# EAGLE design esp32_master_board (EAGLE 9.6.2)
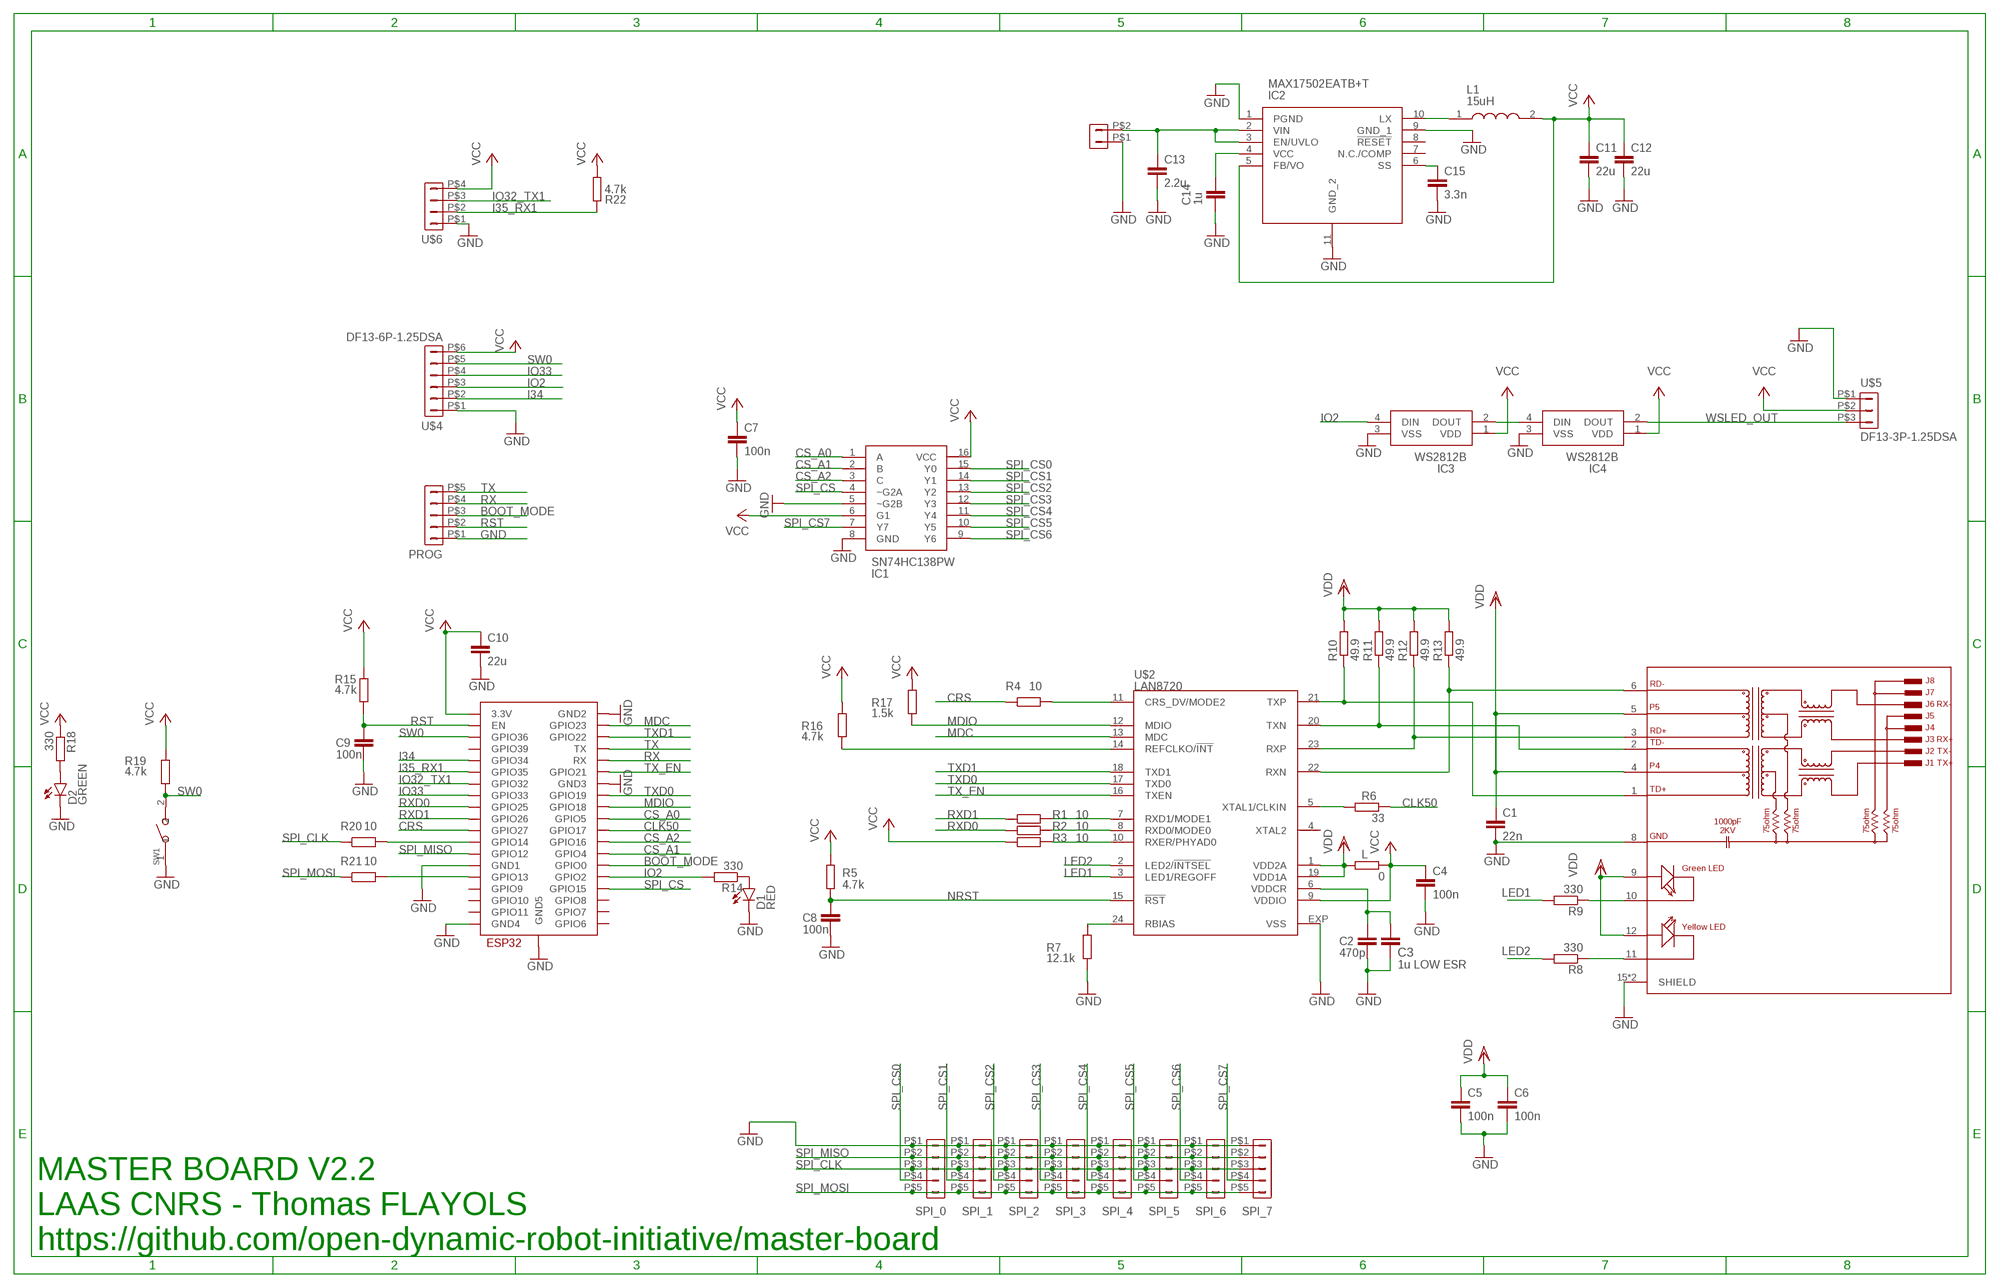
[diagram p0: schematic, sheet 1]

## Parts
C1  22n  C-EUC0402  [0402]
C2  470p  C-EUC0402  [0402]
C3  1u LOW ESR  C-EUC0402  [0402]
C4  100n  C-EUC0402  [0402]
C5  100n  C-EUC0402  [0402]
C6  100n  C-EUC0402  [0402]
C7  100n  C-EUC0402  [0402]
C8  100n  C-EUC0402  [0402]
C9  100n  C-EUC0402  [0402]
C10  22u  C-EUC0805  [C0805]
C11  22u  C-EUC0805  [C0805]
C12  22u  C-EUC0805  [C0805]
C13  2.2u  C-EUC1210  [C1210]
C14  1u  C-EUC0402  [0402]
C15  3.3n  C-EUC0402  [0402]
D1  RED  LEDCHIPLED_0603  [CHIPLED_0603]
D2  GREEN  LEDCHIPLED_0603  [CHIPLED_0603]
IC1  SN74HC138PW  [SOP65P640X120-16N]
IC2  MAX17502EATB+T  [SON50P200X300X80-11N]
IC3  WS2812B  [WS2812B]
IC4  WS2812B  [WS2812B]
L  0  R-EU_R0402  [0402]
L1  15uH  LPS6235-153MRB  [LPS6235]
POWER  DF13-2P-1.25DSA  [DF13-2P-1.25DSA]
PROG  DF13-5P-1.25DSA  [DF13-5P-1.25DSA]
R1  10  R-EU_R0402  [0402]
R2  10  R-EU_R0402  [0402]
R3  10  R-EU_R0402  [0402]
R4  10  R-EU_R0402  [0402]
R5  4.7k  R-EU_R0402  [0402]
R6  33  R-EU_R0402  [0402]
R7  12.1k  R-EU_R0402  [0402]
R8  330  R-EU_R0402  [0402]
R9  330  R-EU_R0402  [0402]
R10  49.9  R-EU_R0402  [0402]
R11  49.9  R-EU_R0402  [0402]
R12  49.9  R-EU_R0402  [0402]
R13  49.9  R-EU_R0402  [0402]
R14  330  R-EU_R0402  [0402]
R15  4.7k  R-EU_R0402  [0402]
R16  4.7k  R-EU_R0402  [0402]
R17  1.5k  R-EU_R0402  [0402]
R18  330  R-EU_R0402  [0402]
R19  4.7k  R-EU_R0402  [0402]
R20  10  R-EU_R0402  [0402]
R21  10  R-EU_R0402  [0402]
R22  4.7k  R-EU_R0402  [0402]
SPI_0  DF13-5P-1.25DSA  [DF13-5P-1.25DSA]
SPI_1  DF13-5P-1.25DSA  [DF13-5P-1.25DSA]
SPI_2  DF13-5P-1.25DSA  [DF13-5P-1.25DSA]
SPI_3  DF13-5P-1.25DSA  [DF13-5P-1.25DSA]
SPI_4  DF13-5P-1.25DSA  [DF13-5P-1.25DSA]
SPI_5  DF13-5P-1.25DSA  [DF13-5P-1.25DSA]
SPI_6  DF13-5P-1.25DSA  [DF13-5P-1.25DSA]
SPI_7  DF13-5P-1.25DSA  [DF13-5P-1.25DSA]
SW1  B3U-1000P-2P-SMD  SMD-BUTTON(2P-3.0X2.5X1.2+0.4MM)-B3U-1000P-2P-SMD  [SW2-2.6-3.0X2.5X1.2+0.4MM]
U$1  ESP32-WROOM  [ESP32-WROOM]
U$2  LAN8720  [QFN24]
U$3  HR911105A  [HANRUN_HR911105A]
U$4  DF13-6P-1.25DSA  [DF13-6P-1.25DSA]
U$5  DF13-3P-1.25DSA  [DF13-3P-1.25DSA]
U$6  DF13-4P-1.25DSA  [DF13-4P-1.25DSA]

## Nets
BOOT_MODE: PROG.P$3 U$1.IO0(GPIO0)
CLK50: R6.1 U$1.IO17(GPIO17)
CRS: R4.1 U$1.IO27(GPIO27)
CS_A0: IC1.1(A) U$1.IO5(GPIO5)
CS_A1: IC1.2(B) U$1.IO4(GPIO4)
CS_A2: IC1.3(C) U$1.IO16(GPIO16)
GND: C1.2 C2.2 C3.2 C4.2 C5.2 C6.2 C7.2 C8.2 C9.2 C10.2 C11.2 C12.2 C13.2 C14.1 C15.2 D1.C D2.C IC1.5(~G2B) IC1.8(GND) IC2.1(PGND) IC2.9(GND_1) IC2.11(GND_2) IC3.3(VSS) IC4.3(VSS) POWER.P$1 PROG.P$1 R7.1 SPI_0.P$1 SPI_1.P$1 SPI_2.P$1 SPI_3.P$1 SPI_4.P$1 SPI_5.P$1 SPI_6.P$1 SPI_7.P$1 SW1.1 U$1.GND1 U$1.GND2 U$1.GND3 U$1.GND4 U$1.GND5 U$2.EXP(VSS) U$3.8(GND) U$3.15(SHIELD) U$3.16(SHIELD) U$4.P$1 U$5.P$1 U$6.P$1
I34: U$1.IO34(GPIO34) U$4.P$2
I35_RX1: R22.2 U$1.IO35(GPIO35) U$6.P$2
IO2: IC3.4(DIN) R14.2 U$1.IO2(GPIO2) U$4.P$3
IO32_TX1: U$1.IO32(GPIO32) U$6.P$3
IO33: U$1.IO33(GPIO33) U$4.P$4
LED1: R9.2 U$2.3(LED1/REGOFF)
LED2: R8.2 U$2.2(LED2/!INTSEL)
MDC: U$1.IO23(GPIO23) U$2.13(MDC)
MDIO: R17.1 U$1.IO18(GPIO18) U$2.12(MDIO)
N$1: R1.2 U$2.7(RXD1/MODE1)
N$2: R2.2 U$2.8(RXD0/MODE0)
N$3: R3.2 U$2.10(RXER/PHYAD0)
N$4: R4.2 U$2.11(CRS_DV/MODE2)
N$5: R6.2 U$2.5(XTAL1/CLKIN)
N$6: R7.2 U$2.24(RBIAS)
N$7: R10.1 U$2.21(TXP) U$3.1(TD+)
N$8: R11.1 U$2.20(TXN) U$3.2(TD-)
N$9: R12.1 U$2.23(RXP) U$3.3(RD+)
N$10: R13.1 U$2.22(RXN) U$3.6(RD-)
N$11: R8.1 U$3.11(YC)
N$12: R9.1 U$3.10(GC)
N$13: R16.1 U$2.14(REFCLKO/!INT)
N$14: C2.1 C3.1 U$2.6(VDDCR)
N$15: C14.2 IC2.4(VCC)
N$16: D1.A R14.1
N$17: R21.2 U$1.IO13(GPIO13)
N$18: IC2.10(LX) L1.1
N$19: IC3.2(DOUT) IC4.4(DIN)
N$20: D2.A R18.2
N$21: R20.2 U$1.IO14(GPIO14)
N$23: C15.1 IC2.6(SS)
N$25: C13.1 IC2.2(VIN) IC2.3(EN/UVLO) POWER.P$2
NRST: C8.1 R5.1 U$2.15(!RST)
RST: C9.1 PROG.P$2 R15.1 U$1.EN
RX: PROG.P$4 U$1.RX
RXD0: R2.1 U$1.IO25(GPIO25)
RXD1: R1.1 U$1.IO26(GPIO26)
SPI_CLK: R20.1 SPI_0.P$3 SPI_1.P$3 SPI_2.P$3 SPI_3.P$3 SPI_4.P$3 SPI_5.P$3 SPI_6.P$3 SPI_7.P$3
SPI_CS: IC1.4(~G2A) U$1.IO15(GPIO15)
SPI_CS0: IC1.15(Y0) SPI_0.P$4
SPI_CS1: IC1.14(Y1) SPI_1.P$4
SPI_CS2: IC1.13(Y2) SPI_2.P$4
SPI_CS3: IC1.12(Y3) SPI_3.P$4
SPI_CS4: IC1.11(Y4) SPI_4.P$4
SPI_CS5: IC1.10(Y5) SPI_5.P$4
SPI_CS6: IC1.9(Y6) SPI_6.P$4
SPI_CS7: IC1.7(Y7) SPI_7.P$4
SPI_MISO: SPI_0.P$2 SPI_1.P$2 SPI_2.P$2 SPI_3.P$2 SPI_4.P$2 SPI_5.P$2 SPI_6.P$2 SPI_7.P$2 U$1.IO12(GPIO12)
SPI_MOSI: R21.1 SPI_0.P$5 SPI_1.P$5 SPI_2.P$5 SPI_3.P$5 SPI_4.P$5 SPI_5.P$5 SPI_6.P$5 SPI_7.P$5
SW0: R19.1 SW1.2 U$1.SENSOR_VP(GPIO36) U$4.P$5
TX: PROG.P$5 U$1.TX
TX_EN: U$1.IO21(GPIO21) U$2.16(TXEN)
TXD0: U$1.IO19(GPIO19) U$2.17(TXD0)
TXD1: U$1.IO22(GPIO22) U$2.18(TXD1)
VCC [power]: C4.1 C7.1 C10.1 C11.1 C12.1 IC1.6(G1) IC1.16(VCC) IC2.5(FB/VO) IC3.1(VDD) IC4.1(VDD) L1.2 L.1 R3.1 R5.2 R15.2 R16.2 R17.2 R18.1 R19.2 R22.1 U$1.3V3(3.3V) U$2.9(VDDIO) U$4.P$6 U$5.P$2 U$6.P$4
VDD [power]: C1.1 C5.1 C6.1 L.2 R10.2 R11.2 R12.2 R13.2 U$2.1(VDD2A) U$2.19(VDD1A) U$3.4 U$3.5 U$3.9(GA) U$3.12(YA)
WSLED_OUT: IC4.2(DOUT) U$5.P$3
Unconnected: IC2.7(N.C./COMP) IC2.8(!RESET) U$1.CLK(GPIO6) U$1.CMD(GPIO11) U$1.SD0(GPIO7) U$1.SD1(GPIO8) U$1.SD2(GPIO9) U$1.SD3(GPIO10) U$1.SENSOR_VN(GPIO39) U$2.4(XTAL2)

## Notes on the sheet
- MASTER BOARD V2.2
  LAAS CNRS - Thomas FLAYOLS
  https://github.com/open-dynamic-robot-initiative/master-board

## Library data of the parts
C1 = resistor:C-EU: CAPACITOR, European symbol; MANUFACTURER_PART_NUMBER: 885012205052
C2 = resistor:C-EU: CAPACITOR, European symbol; MANUFACTURER_PART_NUMBER: CL05C471JB5NNNC
C3 C14 = resistor:C-EU: CAPACITOR, European symbol; MANUFACTURER_PART_NUMBER: CPL-CAP-X5R-0402-1UF-6.3V
C4-C9 = resistor:C-EU: CAPACITOR, European symbol; MANUFACTURER_PART_NUMBER: CPL-CAP-X7R-0402-100NF-16V
C10-C12 = rcl:C-EU: CAPACITOR, European symbol; MANUFACTURER_PART_NUMBER: CPL-CAP-X5R-0805-22UF-6.3V; SPICEPREFIX: C
C13 = resistor:C-EU: CAPACITOR, European symbol; MANUFACTURER_PART_NUMBER: C3225X7R1H225K250AB
C15 = resistor:C-EU: CAPACITOR, European symbol; MANUFACTURER_PART_NUMBER: 885012205064
D1 = led:LED: LED OSRAM: - CHIPLED LG R971, LG N971, LY N971, LG Q971, LY Q971, LO R971, LY R971 LH N974, LH R974 LS Q976, LO Q976, LY Q976 LO Q996 - Hyper CHIPLED LW Q18S LB Q993, LB Q99A, LB R99A - SideLED LS A670, LO A670, LY A670, LG A670, LP A670 LB A673, LV A673, LT A673, LW A673 LH A674 LY A675 LS A676, LA A676, LO A676, LY A676, LW A676 LS A679, LY A679, LG A679 - Hyper Micro SIDELED® LS Y876, LA Y876, LO Y876, LY Y876 LT Y87S - SmartLED LW L88C, LW L88S LB L89C, LB L89S, LG L890 LS L89K, LO L89K, LY L89K LS L896, LA L896, LO L896, LY L896 - TOPLED LS T670, LO T670, LY T670, LG T670, LP T670 LSG T670, LSP T670, LSY T670, LOP T670, LYG T670 LG T671, LOG T671, LSG T671 LB T673, LV T673, LT T673, LW T673 LH T674 LS T676, LA T676, LO T676, LY T676, LB T676, LH T676, LSB T676, LW T676 LB T67C, LV T67C, LT T67C, LS T67K, LO T67K, LY T67K, LW E67C LS E67B, LA E67B, LO E67B, LY E67B, LB E67C, LV E67C, LT E67C LW T67C LS T679, LY T679, LG T679 LS T770, LO T770, LY T770, LG T770, LP T770 LB T773, LV T773, LT T773, LW T773 LH T774 LS E675, LA E675, LY E675, LS T675 LS T776, LA T776, LO T776, LY T776, LB T776 LHGB T686 LT T68C, LB T68C - Hyper Mini TOPLED® LB M676 - Mini TOPLED Santana® LG M470 LS M47K, LO M47K, LY M47K Source: http://www.osram.convergy.de LUXEON: - LUMILED® LXK2-PW12-R00, LXK2-PW12-S00, LXK2-PW14-U00, LXK2-PW14-V00 LXK2-PM12-R00, LXK2-PM12-S00, LXK2-PM14-U00 LXK2-PE12-Q00, LXK2-PE12-R00, LXK2-PE12-S00, LXK2-PE14-T00, LXK2-PE14-U00 LXK2-PB12-K00, LXK2-PB12-L00, LXK2-PB12-M00, LXK2-PB14-N00, LXK2-PB14-P00, LXK2-PB14-Q00 LXK2-PR12-L00, LXK2-PR12-M00, LXK2-PR14-Q00, LXK2-PR14-R00 LXK2-PD12-Q00, LXK2-PD12-R00, LXK2-PD12-S00 LXK2-PH12-R00, LXK2-PH12-S00 LXK2-PL12-P00, LXK2-PL12-Q00, LXK2-PL12-R00 Source: www.luxeon.com KINGBRIGHT: KA-3528ASYC Source: www.kingbright.com; MANUFACTURER_PART_NUMBER: CPL-LED-0603-RED
D2 = led:LED: LED OSRAM: - CHIPLED LG R971, LG N971, LY N971, LG Q971, LY Q971, LO R971, LY R971 LH N974, LH R974 LS Q976, LO Q976, LY Q976 LO Q996 - Hyper CHIPLED LW Q18S LB Q993, LB Q99A, LB R99A - SideLED LS A670, LO A670, LY A670, LG A670, LP A670 LB A673, LV A673, LT A673, LW A673 LH A674 LY A675 LS A676, LA A676, LO A676, LY A676, LW A676 LS A679, LY A679, LG A679 - Hyper Micro SIDELED® LS Y876, LA Y876, LO Y876, LY Y876 LT Y87S - SmartLED LW L88C, LW L88S LB L89C, LB L89S, LG L890 LS L89K, LO L89K, LY L89K LS L896, LA L896, LO L896, LY L896 - TOPLED LS T670, LO T670, LY T670, LG T670, LP T670 LSG T670, LSP T670, LSY T670, LOP T670, LYG T670 LG T671, LOG T671, LSG T671 LB T673, LV T673, LT T673, LW T673 LH T674 LS T676, LA T676, LO T676, LY T676, LB T676, LH T676, LSB T676, LW T676 LB T67C, LV T67C, LT T67C, LS T67K, LO T67K, LY T67K, LW E67C LS E67B, LA E67B, LO E67B, LY E67B, LB E67C, LV E67C, LT E67C LW T67C LS T679, LY T679, LG T679 LS T770, LO T770, LY T770, LG T770, LP T770 LB T773, LV T773, LT T773, LW T773 LH T774 LS E675, LA E675, LY E675, LS T675 LS T776, LA T776, LO T776, LY T776, LB T776 LHGB T686 LT T68C, LB T68C - Hyper Mini TOPLED® LB M676 - Mini TOPLED Santana® LG M470 LS M47K, LO M47K, LY M47K Source: http://www.osram.convergy.de LUXEON: - LUMILED® LXK2-PW12-R00, LXK2-PW12-S00, LXK2-PW14-U00, LXK2-PW14-V00 LXK2-PM12-R00, LXK2-PM12-S00, LXK2-PM14-U00 LXK2-PE12-Q00, LXK2-PE12-R00, LXK2-PE12-S00, LXK2-PE14-T00, LXK2-PE14-U00 LXK2-PB12-K00, LXK2-PB12-L00, LXK2-PB12-M00, LXK2-PB14-N00, LXK2-PB14-P00, LXK2-PB14-Q00 LXK2-PR12-L00, LXK2-PR12-M00, LXK2-PR14-Q00, LXK2-PR14-R00 LXK2-PD12-Q00, LXK2-PD12-R00, LXK2-PD12-S00 LXK2-PH12-R00, LXK2-PH12-S00 LXK2-PL12-P00, LXK2-PL12-Q00, LXK2-PL12-R00 Source: www.luxeon.com KINGBRIGHT: KA-3528ASYC Source: www.kingbright.com; MANUFACTURER_PART_NUMBER: CPL-LED-0603-GREEN
IC1 = SamacSys_Parts:SN74HC138PW: Texas Instruments SN74HC138PW, Decoder, Demultiplexer, 1-of-8, Inverting, 2 6 V, 16-Pin TSSOP Source: Datasheet <http://www.ti.com/lit/gpn/sn74hc138>; DESCRIPTION: Texas Instruments SN74HC138PW, Decoder, Demultiplexer, 1-of-8, Inverting, 2 6 V, 16-Pin TSSOP; HEIGHT: mm; MANUFACTURER_NAME: Texas Instruments; MANUFACTURER_PART_NUMBER: SN74HC138PW; RS_PART_NUMBER: 6631928; RS_PRICE-STOCK: https://uk.rs-online.com/web/p/products/6631928
IC2 = MAX17502EATB+T:MAX17502EATB+T: MAXIM INTEGRATED PRODUCTS - MAX17502EATB+T - DC/DC CONV, SYNC BUCK, 600KHZ, 125DEG C Source: Datasheet <https://datasheets.maximintegrated.com/en/ds/MAX17502.pdf>; DESCRIPTION: MAXIM INTEGRATED PRODUCTS - MAX17502EATB+T - DC/DC CONV, SYNC BUCK, 600KHZ, 125DEG C; HEIGHT: 0.8mm; MANUFACTURER_NAME: Maxim Integrated; MANUFACTURER_PART_NUMBER: MAX17502EATB+T; MOUSER_PART_NUMBER: 700-MAX17502EATB+T; MOUSER_PRICE-STOCK: https://www.mouser.com/Search/Refine.aspx?Keyword=700-MAX17502EATB%2BT
IC3 IC4 = WS2812B:WS2812B: Intelligent control LED integrated light source Source: Datasheet <https://www.adafruit.com/datasheets/WS2812B.pdf>; DESCRIPTION: Intelligent control LED integrated light source; HEIGHT: mm; MANUFACTURER_NAME: Worldsemi; MANUFACTURER_PART_NUMBER: WS2812B
L = resistor:R-EU_: RESISTOR, European symbol; MANUFACTURER_PART_NUMBER: CPL-RES-0402-0-0.063W
L1 = LPS6235-153MRB:LPS6235-153MRB: COILCRAFT - LPS6235-153MRB - INDUCTOR, SHLD, 15UH, 20%, 1.7A, SMD Source: Datasheet <https://www.mouser.fr/datasheet/2/597/lps6235-270704.pdf>; DESCRIPTION: COILCRAFT - LPS6235-153MRB - INDUCTOR, SHLD, 15UH, 20%, 1.7A, SMD; HEIGHT: mm; MANUFACTURER_NAME: COILCRAFT; MANUFACTURER_PART_NUMBER: LPS6235-153MRB; MOUSER_PART_NUMBER: 994-LPS6235-153MRB; MOUSER_PRICE-STOCK: https://www.mouser.com/Search/Refine.aspx?Keyword=994-LPS6235-153MRB
POWER = con-hirose-df13:DF13-2P-1.25: DF13-2P 1.25mm Pitch Miniature Crimping Connector.; MANUFACTURER_PART_NUMBER: DF13-3P-1.25DSA
PROG SPI_0 SPI_1-SPI_7 = con-hirose-df13:DF13-5P-1.25: DF13-5P 1.25mm Pitch Miniature Crimping Connector.; MANUFACTURER_PART_NUMBER: DF13-5P-1.25DSA
R1-R4 R20 R21 = resistor:R-EU_: RESISTOR, European symbol; MANUFACTURER_PART_NUMBER: CPL-RES-0402-10-0.063W
R5 R15 R16 R19 R22 = resistor:R-EU_: RESISTOR, European symbol; MANUFACTURER_PART_NUMBER: CPL-RES-0402-4.7K-0.063W
R6 = resistor:R-EU_: RESISTOR, European symbol; MANUFACTURER_PART_NUMBER: CRCW040233R0FKEDC
R7 = resistor:R-EU_: RESISTOR, European symbol; MANUFACTURER_PART_NUMBER: ERJ-U02F1212X
R8 R9 R14 R18 = resistor:R-EU_: RESISTOR, European symbol; MANUFACTURER_PART_NUMBER: RC0402JR-13330RL
R10-R13 = resistor:R-EU_: RESISTOR, European symbol; MANUFACTURER_PART_NUMBER: CRCW040249R9FKEDC
R17 = resistor:R-EU_: RESISTOR, European symbol; MANUFACTURER_PART_NUMBER: ERJ2GEJ152X
SW1 = OPL_Switch:SMD-BUTTON(2P-3.0X2.5X1.2+0.4MM): 311020047; MANUFACTURER_PART_NUMBER: B3U-1000P; MPN: B3U-1000P-2P-SMD
U$1 = ESP32:ESP32-WROOM; MANUFACTURER_PART_NUMBER: ESP32-WROOM-32D
U$2 = microchip-smsc-lan8720:LAN8720: LAN8720A/LAN8720Ai Small Footprint RMII 10/100 Ethernet PHY Transceiver with HP Auto-MDIX Support from SMSC / Microchip <http://www.microchip.com>. (C) 2014 Tomasz Boleslaw CEDRO, cederom@tlen.pl, http://www.tomek.cedro.info. Version 0.1 (2014-01-04): Initial release.; MANUFACTURER_PART_NUMBER: LAN8720A-CP
U$3 = HR911105A_bis:HR911105A: DIP RJ45 Connector; Check prices <https://pricing.snapeda.com/parts/HR911105A/DFRobot/view-part?ref=eda>; AVAILABILITY: Not in stock; DESCRIPTION: HR911105A Ethernet Interface Arduino Platform Evaluation Expansion Board; MANUFACTURER_PART_NUMBER: HR911105A; MF: DFRobot; MP: HR911105A; PACKAGE: None; PRICE: None
U$4 = con-hirose-df13:DF13-6P-1.25: DF13-6P 1.25mm Pitch Miniature Crimping Connector.; MANUFACTURER_PART_NUMBER: DF13-6P-1.25DSA
U$5 = con-hirose-df13:DF13-3P-1.25: DF13-3P 1.25mm Pitch Miniature Crimping Connector.; MANUFACTURER_PART_NUMBER: DF13-3P-1.25DSA
U$6 = con-hirose-df13:DF13-4P-1.25: DF13-4P 1.25mm Pitch Miniature Crimping Connector.; MANUFACTURER_PART_NUMBER: DF13-4P-1.25DSA

## Net classes
1 power: width 0.406 mm

## Board
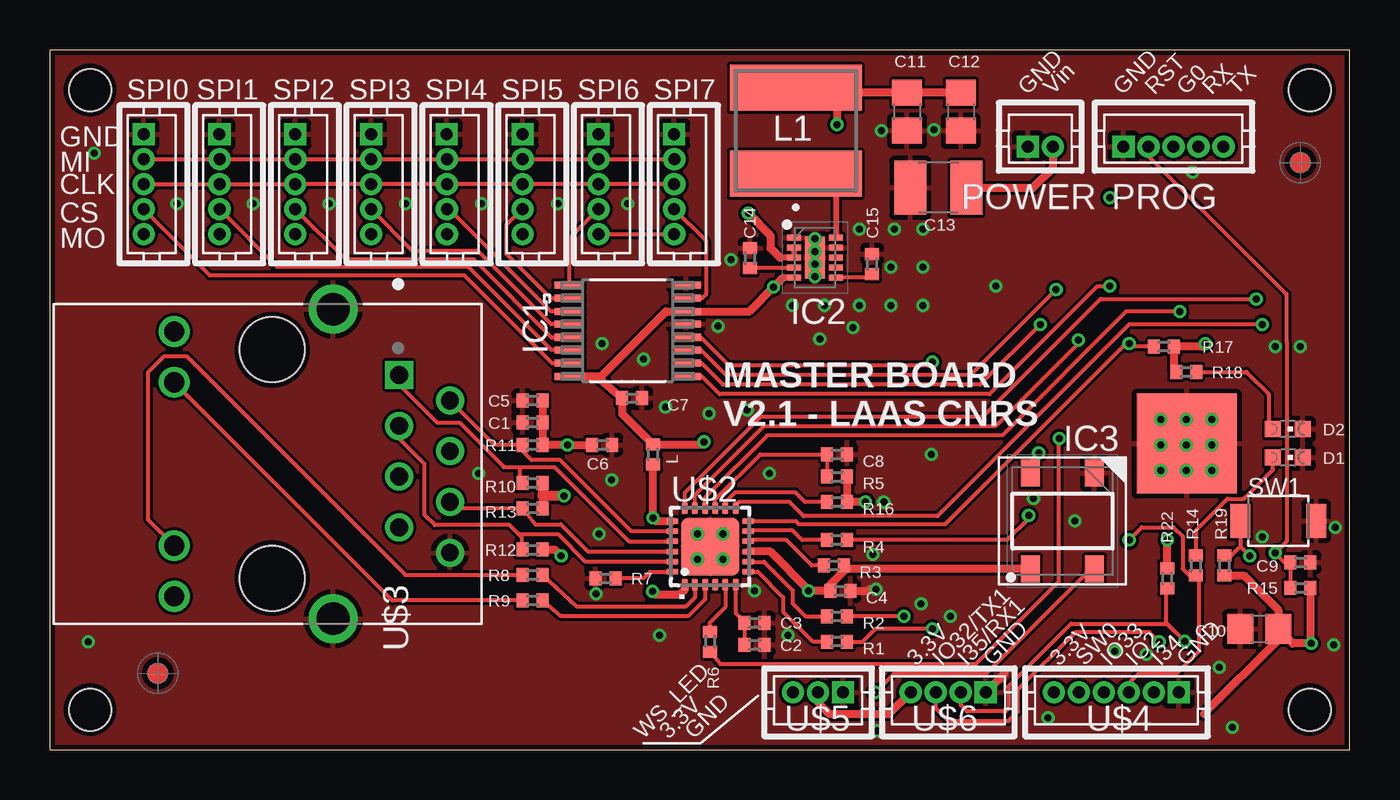
[diagram p1: board, top side]
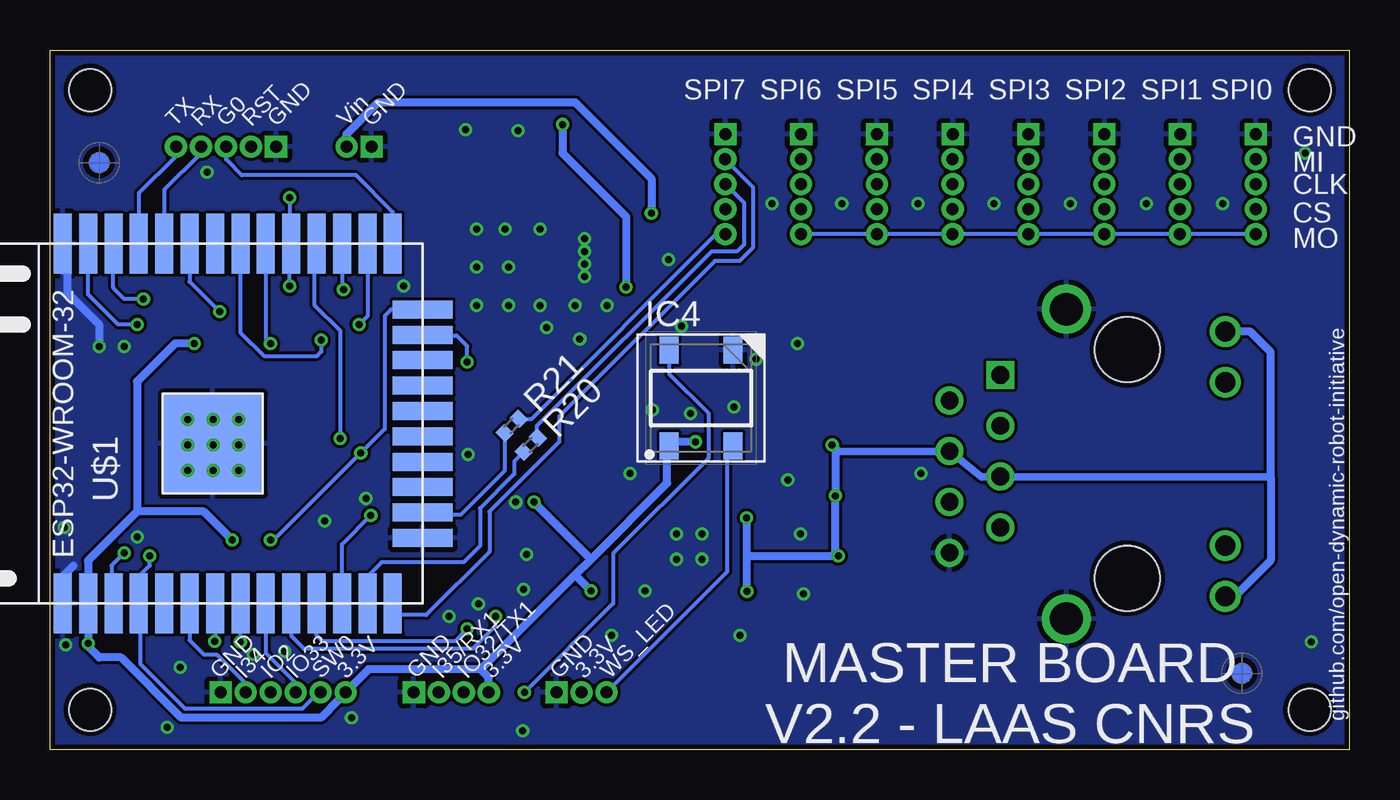
[diagram p2: board, bottom side, seen from below]

Size 65 x 35 mm. Coordinates in mm from the lower left corner, seen from the top.
Outline: 0,35 65,35 65,0 0,0 0,35
Copper layers (1*16): Top 0.035mm / dielectric 1.5mm / Bottom 0.035mm
Design rules "SeeedStudio": minimum track width 6mil, minimum drill 12mil, track to track 6mil, track to pad 6mil, pad to pad 6mil, via to via 6mil, smd to smd 0mil, copper to edge 10mil, drill to drill 10mil, minimum pad ring 10mil, minimum via ring 6mil, stop-mask expansion 2mil, vias tented up to drill 100mil, thermal gap 10mil
Holes 2.1 mm at 2,33 2,2 63,2 63,33

### Footprints (pad centres in the part's own frame; a part is rotated, then mirrored left to right if it is on the bottom)
0402 = smd 0.6 x 0.7: 1 -0.5,0; 2 0.5,0
C0805 = smd 1.3 x 1.5: 1 -0.95,0; 2 0.95,0
C1210 = smd 1.6 x 2.7: 1 -1.4,0; 2 1.4,0
CHIPLED_0603 = smd 0.8 x 0.8: A 0,-0.75; C 0,0.75
SOP65P640X120-16N = smd 1.473 x 0.356: 1 -2.921,2.286; 2 -2.921,1.626; 3 -2.921,0.965; 4 -2.921,0.33; 5 -2.921,-0.33; 6 -2.921,-0.965; 7 -2.921,-1.626; 8 -2.921,-2.286; 9 2.921,-2.286; 10 2.921,-1.626; 11 2.921,-0.965; 12 2.921,-0.33; 13 2.921,0.33; 14 2.921,0.965; 15 2.921,1.626; 16 2.921,2.286
SON50P200X300X80-11N = smd 0.7 x 0.3: 1 -1.05,1; 2 -1.05,0.5; 3 -1.05,0; 4 -1.05,-0.5; 5 -1.05,-1; 6 1.05,-1; 7 1.05,-0.5; 8 1.05,0; 9 1.05,0.5; 10 1.05,1 | smd 1 x 2.1: 11 0,0
WS2812B = smd 1.35 x 0.95: 1 -2.4,1.6; 2 -2.4,-1.6; 3 2.4,-1.6; 4 2.4,1.6
LPS6235 = smd 2.3 x 6.6: 1 -2.15,0; 2 2.15,0
DF13-2P-1.25DSA = drill 0.6 pad 1.016 square: P$1 0.625,0 | drill 0.6 pad 1.016: P$2 -0.625,0
DF13-5P-1.25DSA = drill 0.6 pad 1.016 square: P$1 2.5,0.005 | drill 0.6 pad 1.016: P$2 1.25,-0.005; P$3 0,0; P$4 -1.25,0; P$5 -2.5,0
SW2-2.6-3.0X2.5X1.2+0.4MM = smd 1 x 1.7: 1 -1.9,0; 2 1.9,0
ESP32-WROOM = smd 3 x 0.9: 3V3 0,16.74; EN 0,15.47; GND1 0,18.01; GND3 18,18.01; IO0 18,1.5; IO4 18,2.77; IO5 18,6.58; IO12 0,1.5; IO14 0,2.77; IO16 18,4.04; IO17 18,5.31; IO18 18,7.85; IO19 18,9.12; IO21 18,11.66; IO22 18,15.47; IO23 18,16.74; IO25 0,6.58; IO26 0,5.31; IO27 0,4.04; IO32 0,9.12; IO33 0,7.85; IO34 0,11.66; IO35 0,10.39; NC 18,10.39; RX 18,12.93; SENSOR_VN 0,12.93; SENSOR_VP 0,14.2; TX 18,14.2 | smd 0.9 x 3: CLK 9.635,0; CMD 8.365,0; GND2 3.285,0; IO2 14.715,0; IO13 4.555,0; IO15 13.445,0; SD0 10.905,0; SD1 12.175,0; SD2 5.825,0; SD3 7.095,0 | smd 5 x 5: GND4 8,10.5 | smd 5 x 5 bottom: GND5 8,10.5
QFN24 = smd 0.6 x 0.3: 1 -1.905,1.27; 2 -1.905,0.762; 3 -1.905,0.254; 4 -1.905,-0.254; 5 -1.905,-0.762; 6 -1.905,-1.27; 13 1.905,-1.27; 14 1.905,-0.762; 15 1.905,-0.254; 16 1.905,0.254; 17 1.905,0.762; 18 1.905,1.27 | smd 0.3 x 0.6: 7 -1.27,-1.905; 8 -0.762,-1.905; 9 -0.254,-1.905; 10 0.254,-1.905; 11 0.762,-1.905; 12 1.27,-1.905; 19 1.27,1.905; 20 0.762,1.905; 21 0.254,1.905; 22 -0.254,1.905; 23 -0.762,1.905; 24 -1.27,1.905 | smd 2.9 x 2.9: EXP 0,0
HANRUN_HR911105A = drill 0.89 square: 1 4.45,-6.35 | drill 0.89: 2 3.18,-8.89; 3 1.91,-6.35; 4 0.64,-8.89; 5 -0.63,-6.35; 6 -1.9,-8.89; 7 -3.17,-6.35; 8 -4.44,-8.89 | drill 1.02: 9 6.625,4.9; 10 4.085,4.9; 11 -4.085,4.9; 12 -6.625,4.9 | drill 1.63: 15 7.745,-3.05; 16 -7.745,-3.05 | hole 3.25: -5.715,0; 5.715,0
DF13-6P-1.25DSA = drill 0.6 pad 1.016 square: P$1 3.125,0 | drill 0.6 pad 1.016: P$2 1.875,0; P$3 0.625,0; P$4 -0.625,0; P$5 -1.875,0; P$6 -3.125,0
DF13-3P-1.25DSA = drill 0.6 pad 1.016 square: P$1 1.25,0.005 | drill 0.6 pad 1.016: P$2 0,-0.005; P$3 -1.25,0
DF13-4P-1.25DSA = drill 0.6 pad 1.016 square: P$1 1.875,0 | drill 0.6 pad 1.016: P$2 0.625,0; P$3 -0.625,0; P$4 -1.875,0

### Placement (x,y rotation side)
C1  24.13,16.35 180 top
C2  35.24,5.24 0 top
C3  35.24,6.35 0 top
C4  39.53,7.94 0 top
C5  24.13,17.46 180 top
C6  27.62,15.24 0 top
C7  29.11,17.58 0 top
C8  39.37,14.76 0 top
C9  62.55,9.37 0 top
C10  60.48,6.03 180 top
C11  42.86,31.91 270 top
C12  45.56,31.91 270 top
C13  44.44,28.11 180 top
C14  35.01,24.58 270 top
C15  41.12,24.29 90 top
D1  61.91,14.61 270 top
D2  61.91,16.03 270 top
IC1  28.89,20.95 180 top
IC2  38.26,24.61 0 top
IC3  50.64,11.43 90 top
IC4  32.43,17.58 90 bottom
L  30.16,14.76 270 top
L1  37.31,30.96 90 top
POWER  49.53,30.16 180 top
PROG  56.2,30.16 180 top
R1  39.37,5.4 180 top
R2  39.37,6.67 180 top
R3  39.21,9.21 180 top
R4  39.37,10.48 180 top
R5  39.37,13.65 0 top
R6  33.02,5.4 90 top
R7  27.78,8.57 0 top
R8  24.13,8.73 0 top
R9  24.13,7.46 0 top
R10  24.13,13.34 0 top
R11  24.13,15.24 0 top
R12  24.13,10 0 top
R13  24.13,12.06 0 top
R14  57.31,9.21 270 top
R15  62.55,8.1 0 top
R16  39.37,12.38 0 top
R17  55.72,20.16 0 top
R18  56.83,18.89 0 top
R19  58.74,9.21 270 top
R20  40.96,15.24 225 bottom
R21  41.91,16.19 225 bottom
R22  55.88,8.57 270 top
REF1  [VISION_REF10]  5.4,3.81 0 bottom
REF2  [VISION_REF10]  62.55,29.37 0 bottom
REF3  [VISION_REF10]  5.4,3.81 0 top
REF4  [VISION_REF10]  62.55,29.37 0 top
SPI_0  4.69,28.28 90 top
SPI_1  8.48,28.28 90 top
SPI_2  12.27,28.28 90 top
SPI_3  16.06,28.28 90 top
SPI_4  19.85,28.28 90 top
SPI_5  23.64,28.28 90 top
SPI_6  27.43,28.28 90 top
SPI_7  31.22,28.28 90 top
SW1  61.44,11.43 180 top
U$1  46.35,7.3 90 bottom
U$2  33.02,10.16 90 top
U$3  11.11,14.29 90 top
U$4  53.34,2.86 0 top
U$5  38.42,2.86 0 top
U$6  44.93,2.86 0 top

### Tracks (layer width: path | path; a pad name or v marks a point on that pad's centre or on a via)
BOOT_MODE
  Bottom 0.203: PROG.P$3 56.2,29.53 55.4,28.73 49.69,28.73 47.85,26.9 U$1.IO0
CLK50  (via drill 0.35)
  Top 0.203: v50.48,15.56 50.45,15.53 50.45,8.42 46.32,4.29 33.53,4.29 R6.1
  Bottom 0.203: v50.48,15.56 50.48,20.95 51.75,22.23 51.75,25.21 U$1.IO17
CRS  (via drill 0.35)
  Top 0.203: v48.95,11.72 48.95,11.56 47.87,10.48 R4.1
  Bottom 0.203: v48.95,11.72 50.4,10.27 U$1.IO27
CS_A0  (via drill 0.35)
  Top 0.203: IC1.1 32.61,18.67 33.5,17.78 46.99,17.78 52.39,23.18 v53.02,23.18
  Bottom 0.203: v53.02,27.62 53.02,25.39 U$1.IO5 53.02,25.21 v53.02,23.18
CS_A1  (via drill 0.35)
  Top 0.203: IC1.2 32.58,19.33 33.66,18.26 46.51,18.26 v49.53,21.27
  Bottom 0.203: U$1.IO4 49.12,21.68 v49.53,21.27
CS_A2  (via drill 0.35)
  Top 0.203: IC1.3 32.56,19.99 33.81,18.73 46.04,18.73 v50.32,23.02
  Bottom 0.203: U$1.IO16 50.4,23.09 v50.32,23.02
GND  (via drill 0.35)
  Top 0.406: U$2.EXP v32.38,10.79 | U$2.EXP v33.66,9.53 | U$2.EXP v32.38,9.53 | U$2.EXP v33.66,10.79 | C4.2 40.92,7.94 41,8.02 v41.32,8.02 | U$6.P$1 47.75,3.81
  Bottom 0.203: U$1.GND1 64.36,8.66 | U$1.GND3 64.36,24.04 | U$1.GND4 56.9,15.3 v58.1,16.51 | U$1.GND4 55.65,16.51 v55.56,16.51 | U$1.GND4 55.56,14.01 v55.56,13.97 | U$1.GND4 58.1,14.05 v58.1,13.97
  Bottom 0.406: 64.36,8.66 63.82,9.21 | 64.36,24.04 64.14,23.81 64.14,22.86 62.55,21.27 v62.55,20.16
  other vias: 56.83,15.24 56.83,16.51 55.56,15.24 56.83,13.97 58.1,15.24 47.31,23.18 64.29,11.11 57.15,28.89 2.22,29.84 1.91,5.4 30.48,5.71 27.62,20.32 28.1,13.49 44.22,31.02 30.8,17.14 60.64,10.64 27.46,10.79 49.2,12.55 44.08,14.76 6.35,27.3 10.16,27.3 13.97,27.3 17.78,27.3 21.59,27.3 25.4,27.3 28.89,27.3 35.24,7.94 27.3,7.78 43.57,7.3 29.69,19.53 38.26,24.29 38.26,24.92 38.26,25.56 38.26,23.65 45.03,6.66 35.99,13.8 33.42,21.18 38.5,20.54 32.97,16.82 34.87,16.98 41.16,9.77 34.06,24.51 51.26,11.44 36.91,5.71 53.26,4.91 21.43,13.81 59.13,1.1 41.35,0.95 54.84,4.76 61.28,20.16 40.16,21.11 41.59,30.96 58.5,4.12 41.7,12.38 37.15,22.23 40.48,22.23 42.07,22.23 43.66,22.23 43.66,24.13 38.73,22.23 40.48,26.04 43.66,26.04 42.23,26.04 42.07,24.13 64.21,5.23 49.92,1.58
  pour Top: 0,35 65,35 65,0 0,0
  pour Bottom: 0,35 65,35 65,0 0,0
I34
  Bottom 0.203: U$1.IO34 58.02,5.47 57.31,4.76 56.67,4.76 55.22,3.3 U$4.P$2
I35_RX1  (via drill 0.35)
  Top 0.203: R22.2 55.8,8 55.8,6.36 v56.76,5.41 55.87,6.3 51.06,6.3 47.93,3.16 47.93,2.04 47.79,1.91 45.88,1.91 45.55,2.23 U$6.P$2
  Bottom 0.203: U$1.IO35 56.74,5.42 v56.76,5.41
IO2  (via drill 0.35)
  Top 0.203: IC3.4 49.13,13.92 49.13,14.53 v49.45,14.84 | v53.98,10.48 54.61,11.11 56.2,11.11 56.66,10.65 56.66,9.04 56.99,8.71 R14.2 57.47,8.55 57.47,4.92 56.36,3.81 54.45,3.81 53.97,3.32 U$4.P$3
  Bottom 0.203: U$1.IO2 47.94,22.02 48.26,21.7 48.26,16.03 v49.45,14.84 53.82,10.48 v53.98,10.48
IO32_TX1  (via drill 0.35)
  Top 0.203: U$6.P$3 44.3,2.05 44.93,1.43 47.94,1.43 48.42,1.91 48.42,3.02 51.28,5.87 55,5.87 v55.48,5.4
  Bottom 0.203: U$1.IO32 v55.48,5.4
IO33
  Bottom 0.203: U$1.IO33 54.2,4.83 52.72,3.34 U$4.P$4
LED1
  Top 0.203: R9.2 25.57,6.67 31.91,6.67 32.77,7.53 U$2.3
LED2
  Top 0.203: U$2.2 32.26,7.62 31.78,7.14 26.37,7.14 R8.2
MDC  (via drill 0.35)
  Top 0.203: v60.64,21.27 53.97,21.27 44.38,11.68 37.69,11.68 36.99,12.38 34.45,12.38 34.29,12.22 U$2.13
  Bottom 0.203: v60.64,21.27 61.59,21.27 63.09,22.77 U$1.IO23
MDIO  (via drill 0.35)
  Top 0.203: U$2.12 37.31,11.43 37.47,11.27 44.77,11.27 53.82,20.32 v53.98,20.32 54.13,20.16 R17.1
  Bottom 0.203: U$1.IO18 54.2,20.55 v53.98,20.32
N$1
  Top 0.203: R1.2 38.16,5.4 36.67,6.89 36.67,7.62 35.4,8.89 U$2.7
N$2
  Top 0.203: R2.2 37.78,6.67 37.15,7.3 37.15,7.97 35.72,9.4 U$2.8
N$3
  Top 0.203: R3.2 38.1,9.21 36.83,10.48 34.99,10.48 U$2.10
N$4
  Top 0.203: U$2.11 34.96,10.95 37.15,10.95 37.62,10.48 R4.2
N$5
  Top 0.203: R6.2 33.02,6.37 33.78,7.14 U$2.5
N$6
  Top 0.203: U$2.24 30,8.89 29.69,8.57 R7.2
N$7
  Top 0.203: U$2.21 28.96,10.41 25.24,14.13 23.5,14.13 23.48,14.11 | 23.48,14.11 23.48,14.13 22.7,14.13 20.48,16.35 19.37,16.35 17.46,18.26 U$3.1 | 23.48,14.11 23.48,13.48 R10.1
N$8
  Top 0.203: U$2.20 29.08,10.92 25.52,14.48 24.09,14.48 23.57,15 R11.1 22.23,15.24 U$3.2
N$9
  Top 0.2: 23.61,10.12 23.61,10.71 | 23.61,10.71 23.65,10.76 | 23.48,10.75 23.52,10.71 23.61,10.71
  Top 0.203: U$3.3 17.46,15.56 18.73,14.29 18.73,11.75 19.25,11.23 23,11.23 23.48,10.75 23.49,10.76 23.65,10.76 25.44,10.76 26.8,9.4 U$2.23 | 23.61,10.12 R12.1
N$10
  Top 0.203: R13.1 | R13.1 21.09,12.06 20.32,12.07 U$3.6 | R13.1 24.27,11.27 25.56,11.27 26.92,9.91 U$2.22
N$11
  Top 0.2: U$3.11 4.92,11.49 4.92,18.89 5.71,19.68 6.83,19.68 17.78,8.73 R8.1
N$12
  Top 0.2: R9.1 17.12,7.46 U$3.10
N$13
  Top 0.203: R16.1 37.77,12.38 37.29,12.86 34.26,12.86 33.78,12.38 U$2.14
N$14
  Top 0.2: 34.74,6.37 C3.1 34.74,6.19
  Top 0.203: 34.74,6.19 C2.1 | U$2.6 34.29,6.83 34.74,6.37
N$15
  Top 0.203: C14.2 35.18,24.11 IC2.4
N$16
  Top 0.203: R14.1 57.31,10.95 58.9,12.54 59.7,12.54 61.16,14 D1.A
N$17
  Bottom 0.203: R21.2 42.26,13.93 44.45,11.75 46.24,11.75 U$1.IO13
N$18
  Top 0.305: 39.31,28.71 IC2.10
  Top 0.406: 39.31,28.71 39.21,28.81 L1.1
N$19  (via drill 0.35)
  Top 0.203: IC3.2 52.05,9.03 46.83,3.81 42.23,3.81 v41.27,2.86
  Bottom 0.203: v41.27,2.86 36.83,7.3 36.83,9.8 32.07,14.57 32.07,16.83 34.03,18.79 IC4.4
N$20
  Top 0.203: D2.A 60.96,16.13 60.96,17.78 59.85,18.89 R18.2
N$21
  Bottom 0.203: R20.2 41.79,14.41 41.79,13.78 43.5,12.06 43.5,10.18 44.31,9.37 48.42,9.37 49.12,8.66 U$1.IO14
N$23
  Top 0.203: C15.1 41.08,23.61 IC2.6
N$25  (via drill 0.35)
  Top 0.305: 36.51,24.61 IC2.3 IC2.2
  Top 0.406: v34.92,26.83 36.04,25.72 36.04,25.08 36.51,24.61 | POWER.P$2 50.16,29.09 49.17,28.11 C13.1
  Bottom 0.406: POWER.P$2 50.16,30.17 50.16,30.8 48.58,32.38 38.73,32.38 34.92,28.57 v34.92,26.83
NRST
  Top 0.203: U$2.15 33.27,12.5 35.53,14.76 C8.1 R5.1
RST  (via drill 0.35)
  Top 0.2: 61.85,22.79 61.85,20.41 61.86,20.4 61.86,10.42 v61.28,9.84 61.28,9.82 61.73,9.37 C9.1 R15.1
  Top 0.203: PROG.P$2 54.95,29.69 61.85,22.79
  Bottom 0.203: v61.28,9.84 61.91,9.21 61.91,7.39
  Bottom 0.406: U$1.EN 61.91,7.39
RX
  Bottom 0.203: PROG.P$4 57.45,29.84 59.28,28.01 U$1.RX
RXD0  (via drill 0.35)
  Top 0.203: v42.7,6.67 R2.1
  Bottom 0.203: v42.7,6.67 42.7,6.19 43.83,5.06 52.32,5.06 52.94,5.68 U$1.IO25
RXD1  (via drill 0.35)
  Top 0.203: v44.13,6.03 41.27,6.03 40.64,5.4 R1.1
  Bottom 0.203: v44.13,6.03 44.75,5.42 51.37,5.42 51.66,5.71 U$1.IO26
SPI_CLK
  Top 0.203: SPI_7.P$3 SPI_6.P$3 SPI_5.P$3 SPI_4.P$3 SPI_3.P$3 SPI_2.P$3 SPI_1.P$3 SPI_0.P$3
  Bottom 0.203: SPI_7.P$3 30.27,27.33 30.27,25.29 30.64,24.92 31.91,24.92 40.66,16.18 40.66,15.65 R20.1
SPI_CS  (via drill 0.35)
  Top 0.203: IC1.4 32.56,20.62 33.97,19.21 43.95,19.21 v44.13,19.39
  Bottom 0.203: v44.13,19.39 44.13,20.18 44.66,20.72 46.32,20.72 U$1.IO15
SPI_CS0
  Top 0.203: IC1.15 25.12,19.33 20.72,23.73 7.99,23.73 SPI_0.P$4
SPI_CS1
  Top 0.203: IC1.14 25.09,19.99 20.91,24.17 11.34,24.17 SPI_1.P$4
SPI_CS2
  Top 0.203: IC1.13 25.09,20.62 21.2,24.52 14.78,24.52 SPI_2.P$4
SPI_CS3
  Top 0.203: IC1.12 25.07,21.29 21.38,24.98 18.12,24.98 SPI_3.P$4
SPI_CS4
  Top 0.203: IC1.11 25.07,21.92 19.96,27.03 SPI_4.P$4
SPI_CS5
  Top 0.203: IC1.10 25.04,22.58 22.83,24.79 22.83,26.25 23.61,27.03 SPI_5.P$4
SPI_CS6
  Top 0.203: SPI_6.P$4 25.97,25.57 IC1.9
SPI_CS7
  Top 0.203: IC1.7 32.61,22.58 32.8,22.77 32.8,25.45 SPI_7.P$4
SPI_MISO
  Top 0.203: SPI_0.P$2 SPI_1.P$2 SPI_2.P$2 SPI_3.P$2 SPI_4.P$2 SPI_5.P$2 SPI_6.P$2 SPI_7.P$2
  Bottom 0.203: SPI_7.P$2 29.84,28.14 29.84,25.11 30.5,24.45 31.75,24.45 39.53,16.67 39.53,15.4 43.02,11.91 43.02,9.89 46.18,6.74 47.69,6.74 47.85,6.9 U$1.IO12
SPI_MOSI
  Top 0.203: SPI_6.P$5 SPI_7.P$5
  Bottom 0.203: SPI_0.P$5 SPI_1.P$5 SPI_2.P$5 SPI_3.P$5 SPI_4.P$5 SPI_5.P$5 SPI_6.P$5 | R21.1 40.92,16.55 31.68,25.78 SPI_7.P$5
SW0  (via drill 0.35)
  Top 0.203: R19.1 59.08,9.71 59.54,10.16 SW1.2 59.54,10.15 v60.01,9.68
  Bottom 0.203: v60.01,9.68 60.01,9.21 60.55,8.66 U$1.SENSOR_VP 60.48,7.23 60.48,4.29 58.25,2.05 52.38,2.05 51.57,2.86 U$4.P$5
TX
  Bottom 0.203: PROG.P$5 58.7,29.69 60.55,27.83 U$1.TX
TX_EN  (via drill 0.35)
  Top 0.203: U$2.16 32.77,12.61 35.88,15.72 47.62,15.72 53.82,21.91 v56.52,21.91
  Bottom 0.203: v56.52,21.91 58.02,23.41 U$1.IO21
TXD0  (via drill 0.35)
  Top 0.203: U$2.17 32.26,12.73 35.72,16.19 47.31,16.19 51.44,20.32 v51.44,20.48
  Bottom 0.203: U$1.IO19 55.48,20.87 54.3,19.69 51.65,19.69 51.44,19.9 v51.44,20.48
TXD1  (via drill 0.35)
  Top 0.203: U$2.18 31.75,12.86 35.56,16.67 46.67,16.67 52.55,22.54 v60.33,22.54
  Bottom 0.203: v60.33,22.54 61.28,22.54 61.83,23.09 U$1.IO22
VCC  (via drill 0.35)
  Top 0.305: IC2.5 36.67,23.61
  Top 0.406: U$2.9 36.04,9.91 37.97,7.97 v37.94,7.94 C4.1 39.03,8.26 39.71,8.94 R3.1 39.89,9.03 IC3.1 | v32.7,15.4 32.54,15.24 30.19,15.24 L.1 28.61,16.81 C7.1 27.56,18.48 27.56,18.67 | v57.78,20.32 57.63,20.16 R17.2 56.22,19 R18.1 | R5.2 R16.2 v40.79,12.38 | 27.56,18.67 IC1.16 | 27.56,18.67 30.81,21.92 IC1.6 34.98,21.92 v36.19,23.13 36.67,23.61 | C12.1 C11.1 39.37,32.86 39.37,32.95 39.21,33.11 L1.2 38.81,33.11 39.37,32.54 v39.37,31.27 | U$5.P$2 38.44,2.83 38.44,2.32 38.98,1.78 41.97,1.78 U$6.P$4 | R22.1 v55.88,10.48 | C10.1 62.16,5.31 v63.09,5.31 63.05,5.36 R15.2 | 57.72,1.78 61.43,5.49 C10.1 | R19.2 59.71,8.71 61.43,6.99 C10.1
  Bottom 0.406: v57.78,20.32 58.74,20.32 60.64,18.41 60.64,11.91 | 60.64,11.91 63.09,9.45 U$1.3V3 v63.09,5.31 63.09,5.15 62.55,4.6 61.45,4.6 58.44,1.59 51.44,1.59 50.55,2.48 50.55,2.52 U$4.P$6 49.07,4.01 43.45,4.01 | 38.73,8.73 43.45,4.01 | v39.37,31.27 39.37,29.84 36.19,26.67 v36.19,23.13 | v32.7,15.4 33.81,15.4 IC4.1 34.13,15.08 34.13,13.34 37.94,9.53 | v40.79,12.38 v40.79,12.37 37.94,9.53 | 37.94,9.53 38.73,8.73 | 38.73,8.73 v37.94,7.94 | v55.88,10.48 57.31,11.91 60.64,11.91 | U$6.P$4 43.05,3.61 43.45,4.01
VDD  (via drill 0.35)
  Top 0.406: L.2 v30.16,11.59 30.32,11.43 U$2.19 | R10.2 R13.2 | v25.57,9.68 25.26,10 R12.2 | U$2.1 31.75,8.01 31.49,7.74 30.29,7.74 v30.13,7.9 | C5.1 C1.1 R11.2 v25.88,15.24 C6.1
  Top 0.508: v25.72,12.7 24.63,12.7 R10.2
  Bottom 0.406: v30.13,7.9 30.16,7.94 30.16,9.68 | v30.16,11.59 30.16,9.68 | 30.16,9.68 v25.57,9.68 25.72,9.83 v25.72,12.7 25.72,15.08 v25.88,15.24 25.56,14.93 U$3.4 18.4,13.64 U$3.5 3.94,13.64 | 3.94,13.64 3.94,19.9 4.96,20.91 U$3.9 | 3.94,13.64 3.94,9.46 5.75,7.66 U$3.12
WSLED_OUT
  Bottom 0.203: IC4.2 31.14,14.88 31.14,8.89 U$5.P$3

### Text on the board
tPlace: SPI0 | SPI1 | SPI2 | SPI3 | SPI4 | SPI5 | SPI6 | SPI7 | GND | Vin | GND | RST | G0 | RX | TX | GND | MI | CLK | CS | MO | MASTER BOARD / V2.1 - LAAS CNRS | 3.3V | IO32/TX1 | I35/RX1 | GND | 3.3V | SW0 | IO33 | IO2 | I34 | GND | WS_LED | 3.3V | GND
bPlace: SPI0 | SPI1 | SPI2 | SPI3 | SPI4 | SPI5 | SPI6 | SPI7 | GND | Vin | GND | RST | G0 | RX | TX | GND | MI | CLK | CS | MO | MASTER BOARD / V2.2 - LAAS CNRS | WS_LED | 3.3V | GND | 3.3V | IO32/TX1 | I35/RX1 | GND | 3.3V | SW0 | IO33 | IO2 | I34 | GND
tNames: .
bNames: github.com/open-dynamic-robot-initiative